# Altium schematic sheet 0151_DC JACK & RTC COIN.SchDoc
size 848 x 558 mm
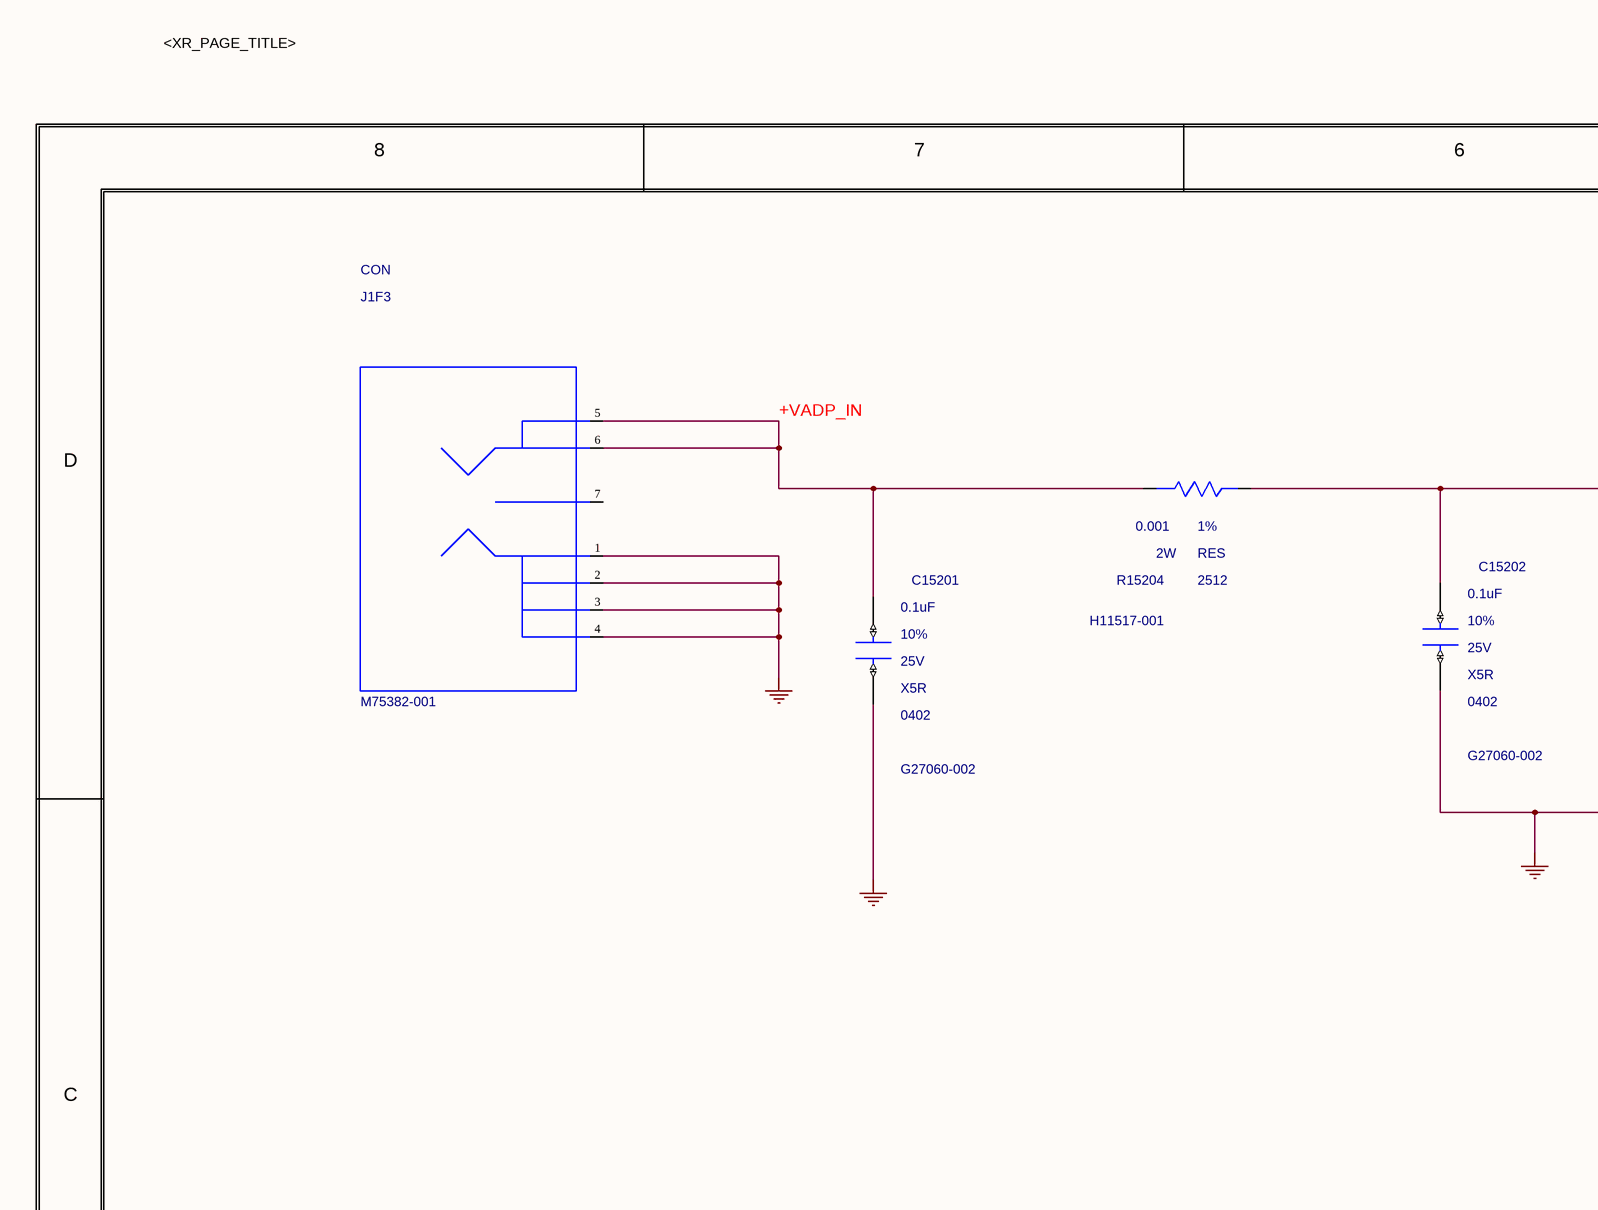
[diagram p0: 0151_DC JACK & RTC COIN.SchDoc, top left]
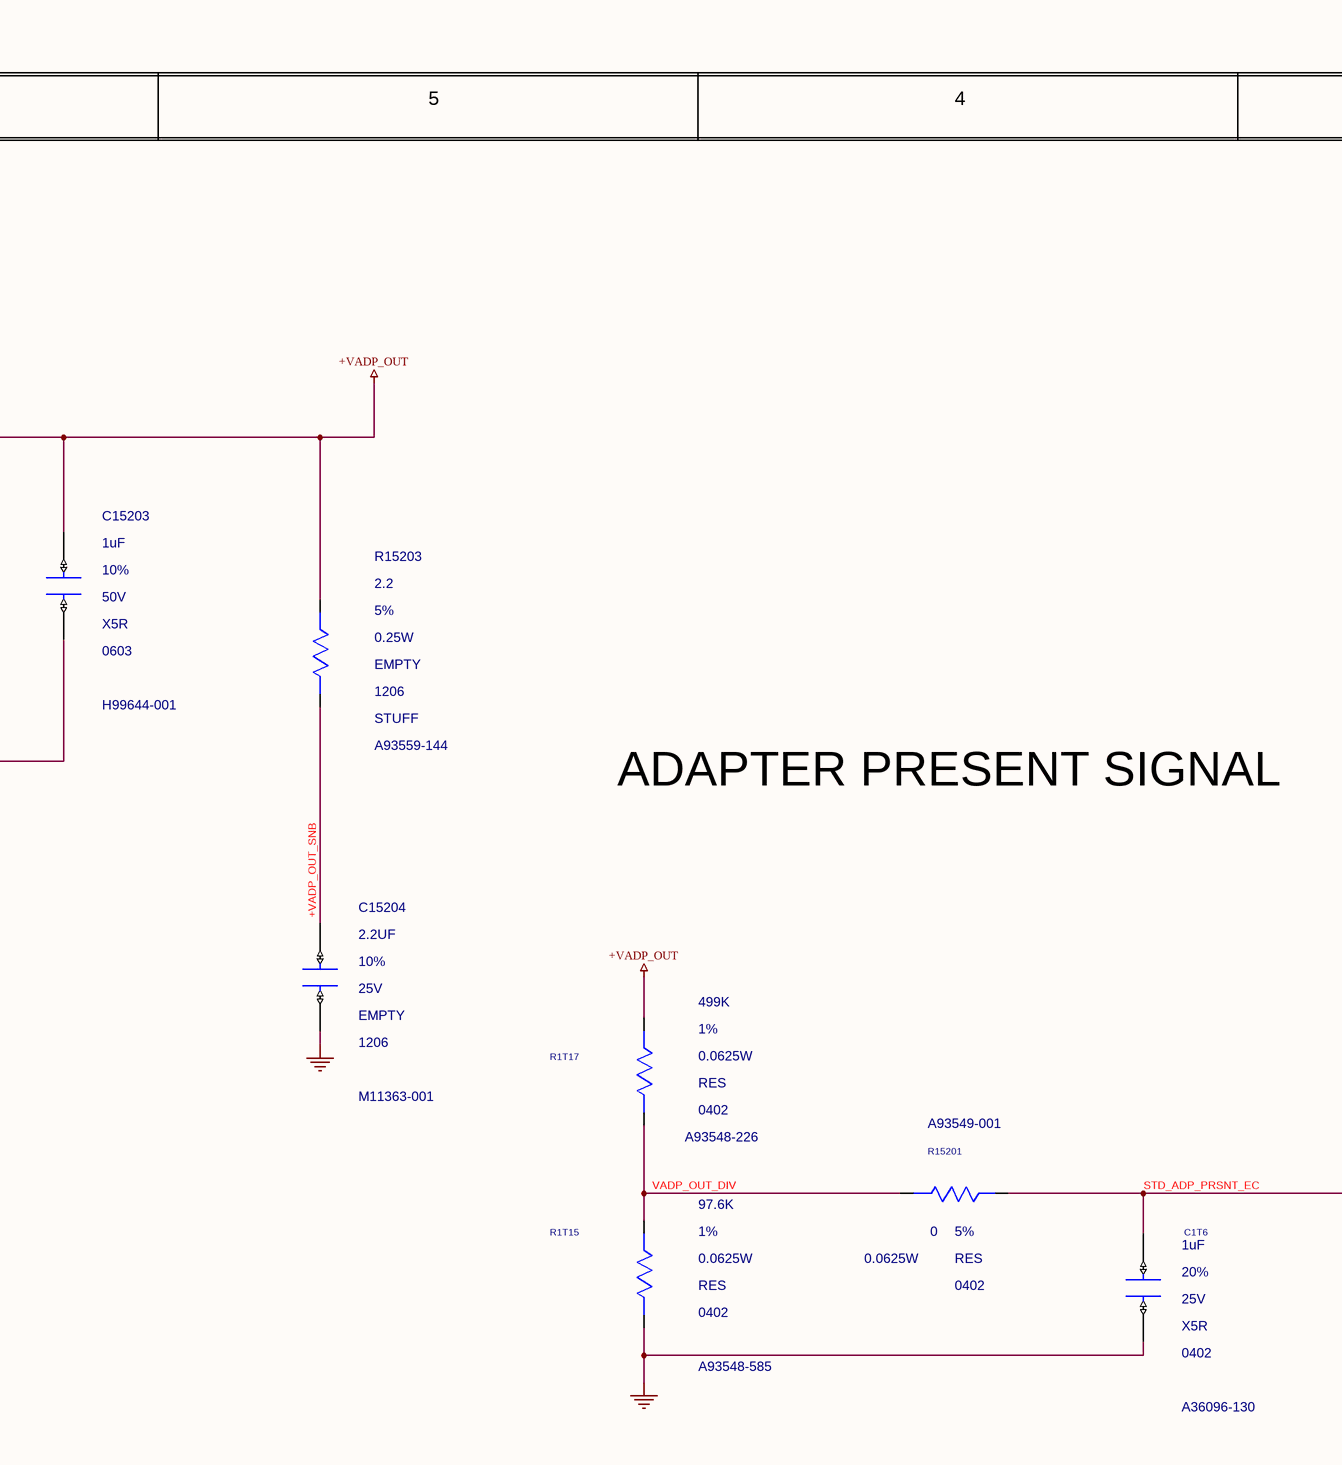
[diagram p1: 0151_DC JACK & RTC COIN.SchDoc, top middle]
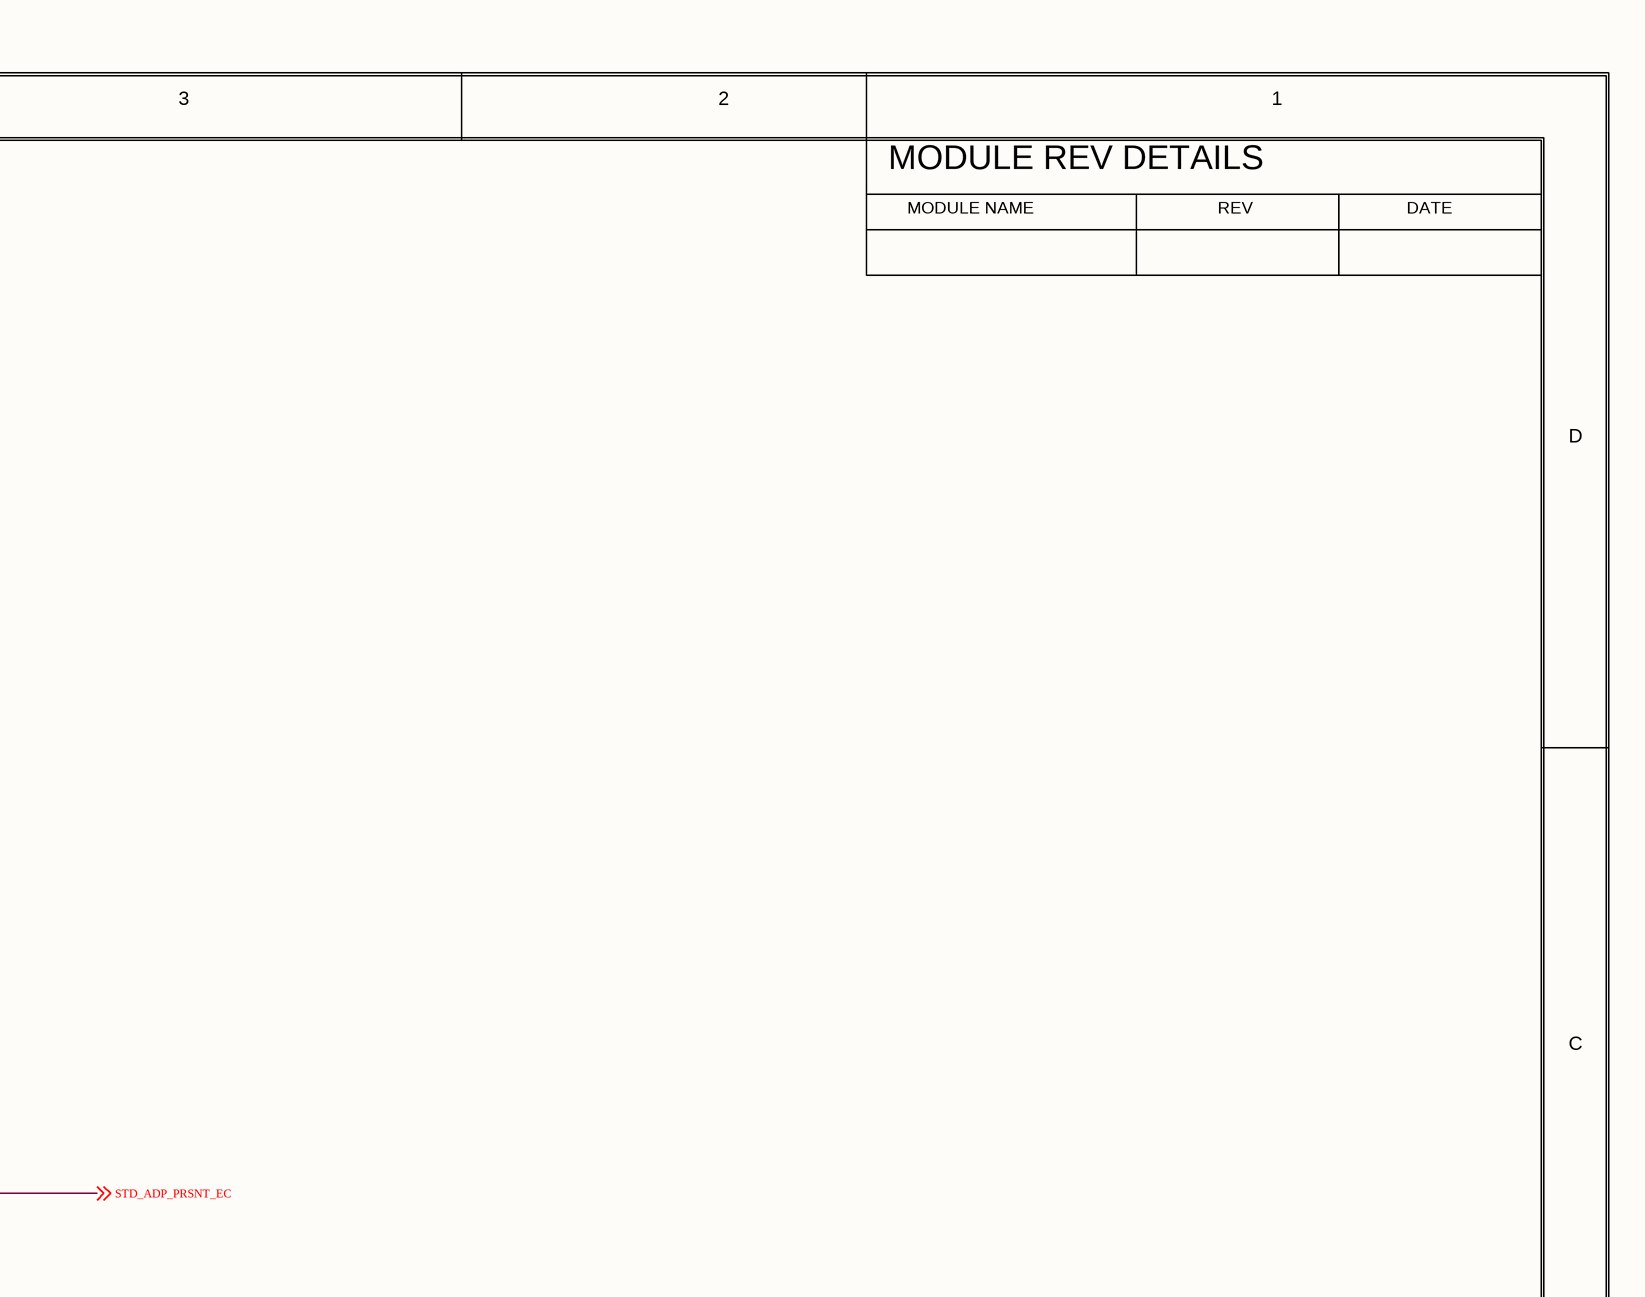
[diagram p2: 0151_DC JACK & RTC COIN.SchDoc, top right]
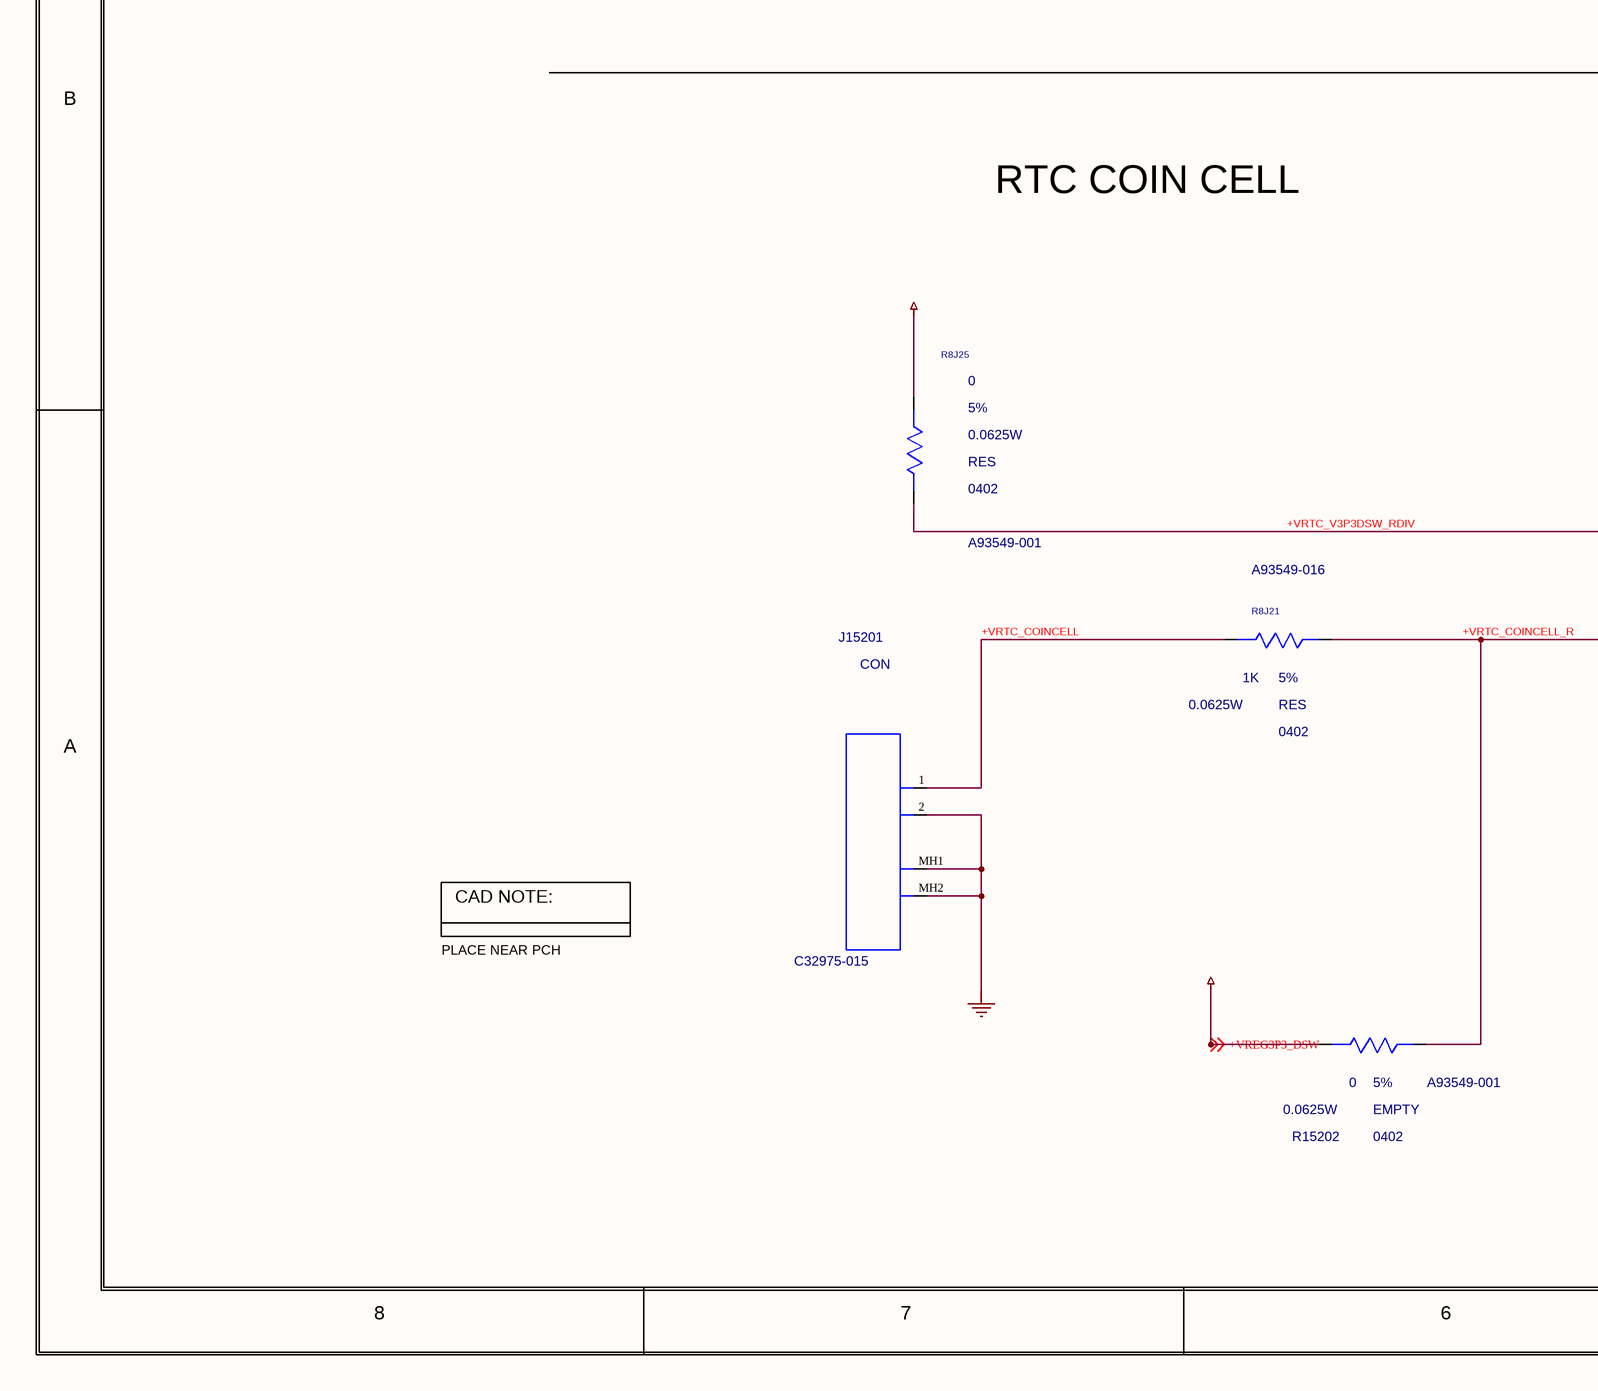
[diagram p3: 0151_DC JACK & RTC COIN.SchDoc, bottom left]
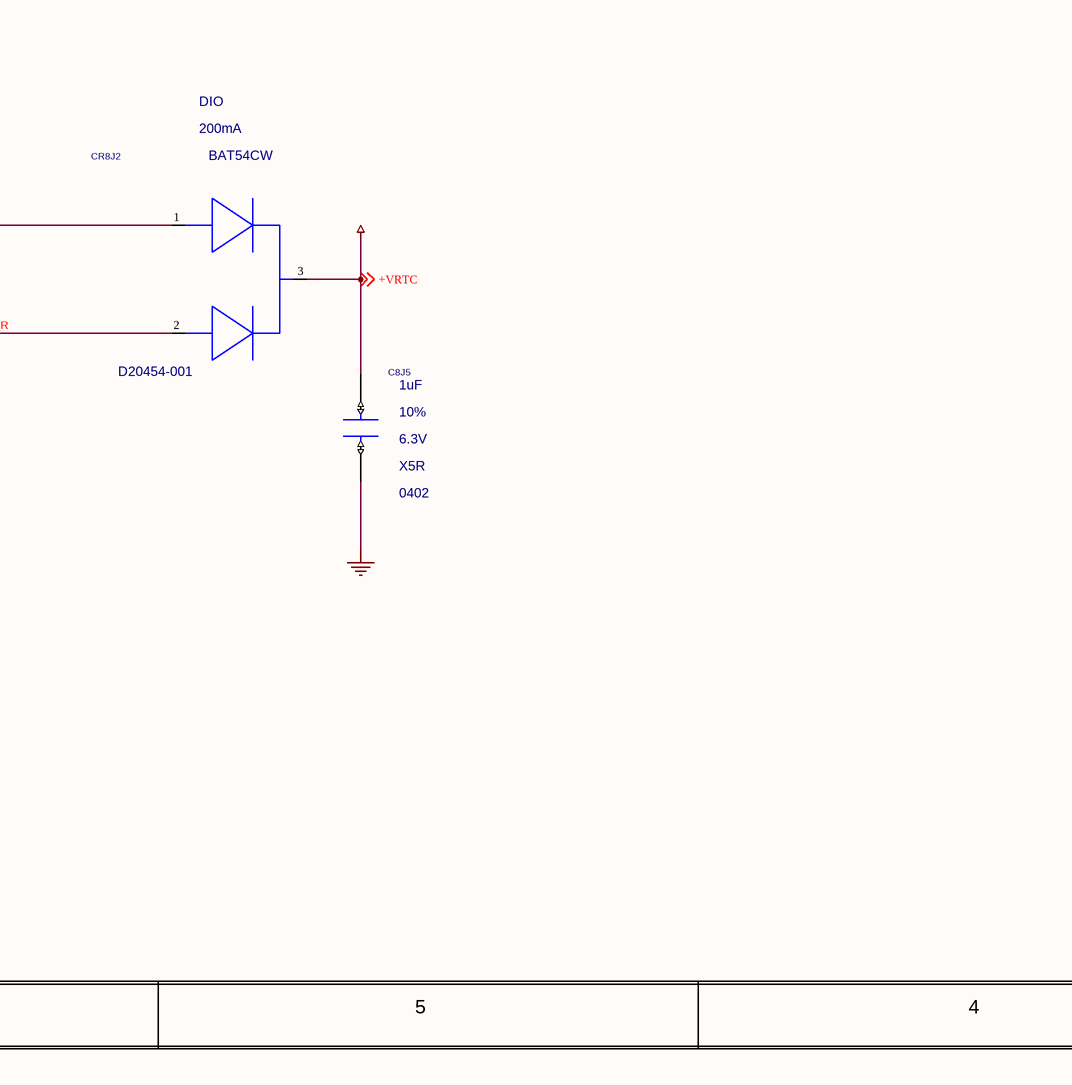
[diagram p4: 0151_DC JACK & RTC COIN.SchDoc, bottom middle]
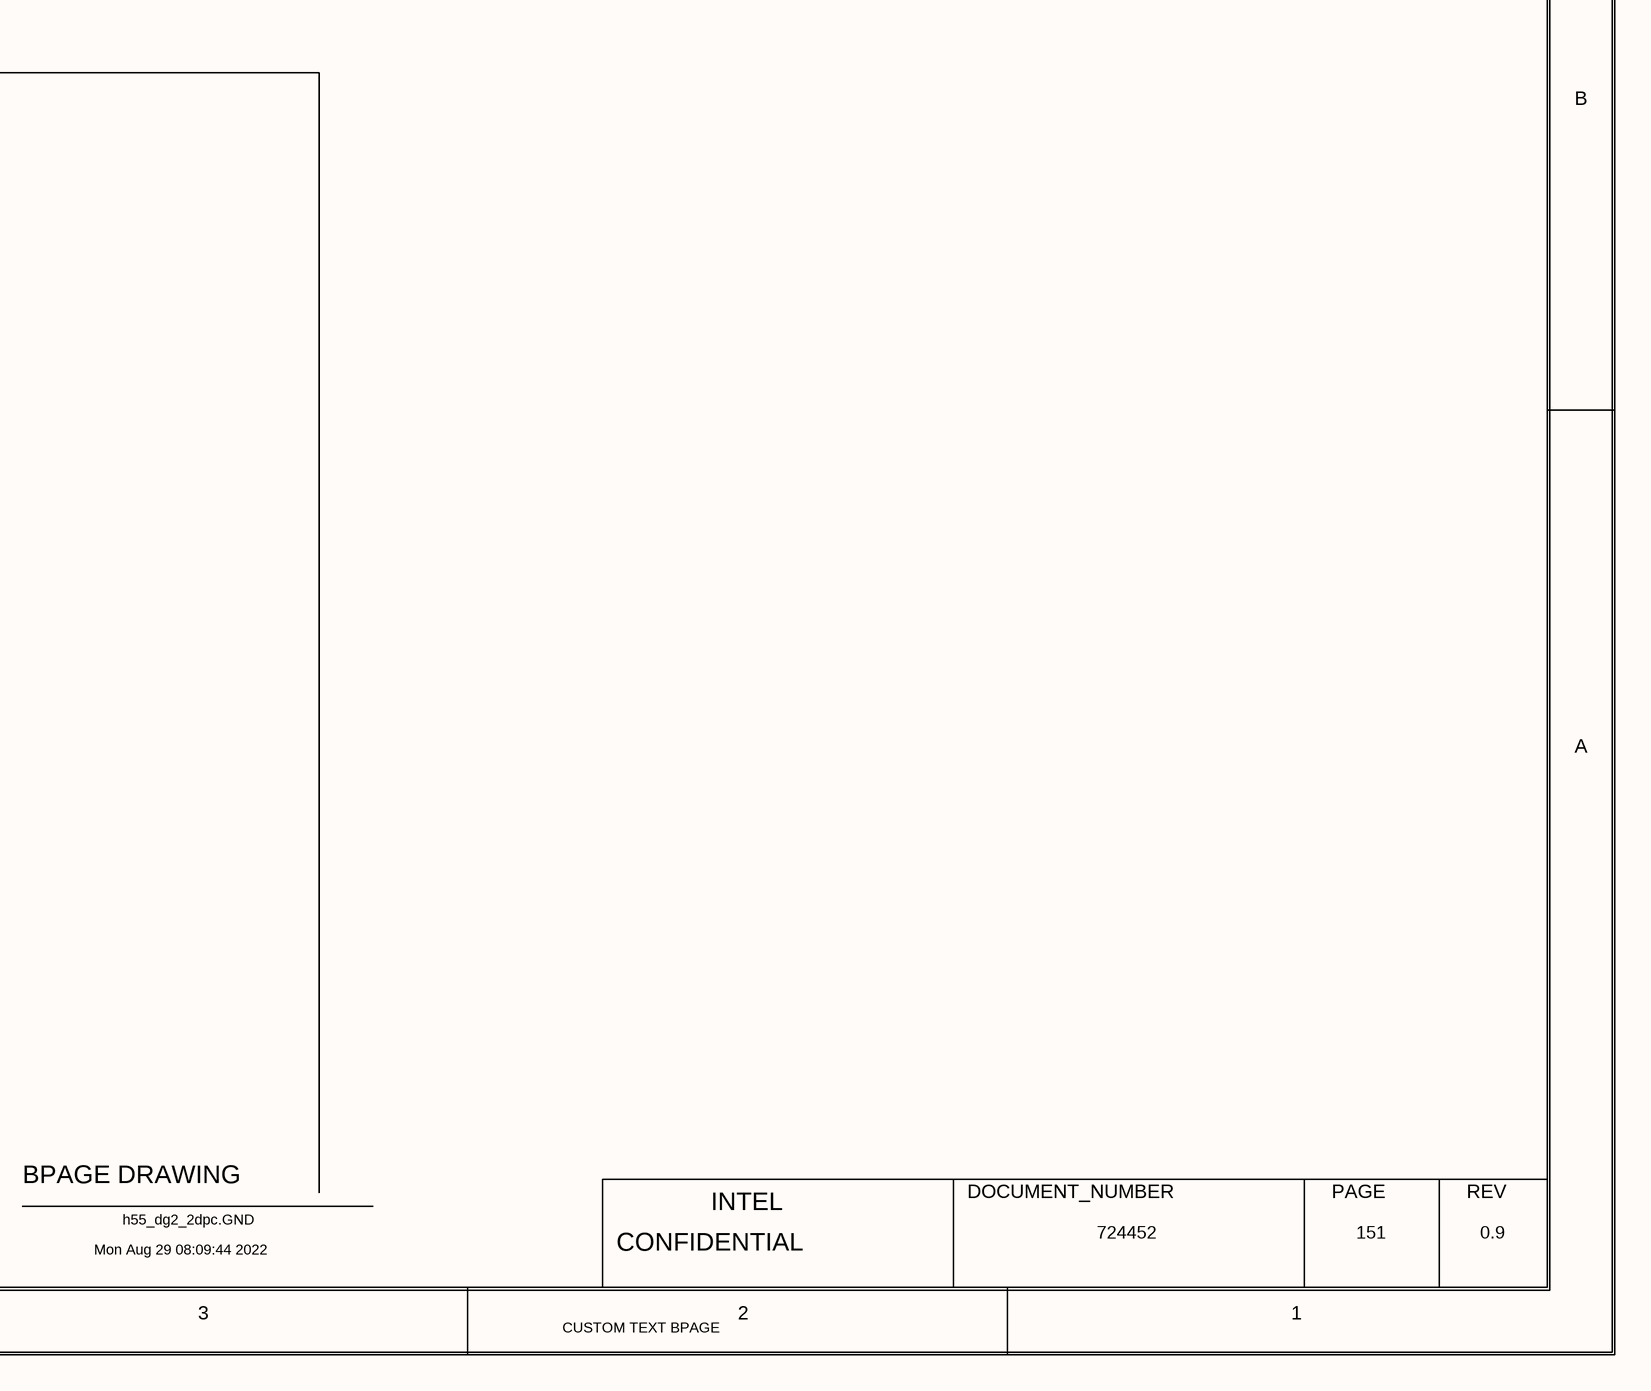
[diagram p5: 0151_DC JACK & RTC COIN.SchDoc, bottom right]

## Parts
C1T6  1uF  MATERIAL: X5R  PACK_TYPE: 0402  PART_NUMBER: A36096-130  TOLERANCE: 20%  VOLTAGE: 25V  [CTK0_SM0402_1050X550_MA]
C8J5  1uF  MATERIAL: X5R  PACK_TYPE: 0402  TOLERANCE: 10%  VOLTAGE: 6.3V  [CTK2_SM0402_1050X550_MA]
C15201  0.1uF  MATERIAL: X5R  PACK_TYPE: 0402  PART_NUMBER: G27060-002  TOLERANCE: 10%  VOLTAGE: 25V  [CTK2_SM0402_1050X550_MA]
C15202  0.1uF  MATERIAL: X5R  PACK_TYPE: 0402  PART_NUMBER: G27060-002  TOLERANCE: 10%  VOLTAGE: 25V  [CTK2_SM0402_1050X550_MA]
C15203  1uF  MATERIAL: X5R  PACK_TYPE: 0603  PART_NUMBER: H99644-001  TOLERANCE: 10%  VOLTAGE: 50V  [CTK0_SM0603_1750X950_MA]
C15204  2.2UF  MATERIAL: EMPTY  PACK_TYPE: 1206  PART_NUMBER: M11363-001  TOLERANCE: 10%  VOLTAGE: 25V  [CTK2_SM1206_3400X1800_MB]
CR8J2  BAT54CW  CURRENT: 200mA  MATERIAL: DIO  PART_NUMBER: D20454-001  [CTK2_SOT323_1350X2200_650_MB]
J1F3  MATERIAL: CON  PART_NUMBER: M75382-001  [CPWR_JACK_MIDJR_7P_1530_MA_PIP_VR]  (hidden comment: C_PWR_JACK_7P)
J15201  MATERIAL: CON  PART_NUMBER: C32975-015  [CTK0_B2B_SPR_1X2_2EM_1250_MA_VR]  (hidden comment: C_B2B_1X2_2EM)
R1T15  97.6K  MATERIAL: RES  PACK_TYPE: 0402  PART_NUMBER: A93548-585  TOLERANCE: 1%  WATTAGE: 0.0625W  [CTK0_SM0402_1100X550_MA]
R1T17  499K  MATERIAL: RES  PACK_TYPE: 0402  PART_NUMBER: A93548-226  TOLERANCE: 1%  WATTAGE: 0.0625W  [CTK0_SM0402_1100X550_MA]
R8J21  1K  MATERIAL: RES  PACK_TYPE: 0402  PART_NUMBER: A93549-016  TOLERANCE: 5%  WATTAGE: 0.0625W  [CTK2_SM0402_1050X550_MA]
R8J25  0  MATERIAL: RES  PACK_TYPE: 0402  PART_NUMBER: A93549-001  TOLERANCE: 5%  WATTAGE: 0.0625W  [CTK0_SM0402_1100X550_MA]
R15201  0  MATERIAL: RES  PACK_TYPE: 0402  PART_NUMBER: A93549-001  TOLERANCE: 5%  WATTAGE: 0.0625W  [CTK0_SM0402_1100X550_MA]
R15202  0  MATERIAL: EMPTY  PACK_TYPE: 0402  PART_NUMBER: A93549-001  TOLERANCE: 5%  WATTAGE: 0.0625W  [CTK0_SM0402_1100X550_MA]
R15203  2.2  BOM_USE: STUFF  MATERIAL: EMPTY  PACK_TYPE: 1206  PART_NUMBER: A93559-144  TOLERANCE: 5%  WATTAGE: 0.25W  [TK0_SM1206_3400X1800_ML]
R15204  0.001  MATERIAL: RES  PACK_TYPE: 2512  PART_NUMBER: H11517-001  TOLERANCE: 1%  WATTAGE: 2W  [CTK2_SM2512_6604X3434_MA]

## Nets
+V3P3DSW: R8J25.1(A)
+VADP_OUT: C15202.1(A) C15203.1(A) R1T17.1(A) R15203.1(A) R15204.2(B)
+VREG3P3_DSW: R15202.1(A) ; off-sheet +VREG3P3_DSW
+VRTC: C8J5.1(A) CR8J2.3(C) ; off-sheet +VRTC
GND: C1T6.2(B) C8J5.2(B) C15201.2(B) C15202.2(B) C15203.2(B) C15204.2(B) J1F3.1(SHELL_M_1) J1F3.2(SHELL_M_2) J1F3.3(SHELL_M_3) J1F3.4(SHELL_M_4) J15201.2(IO2) J15201.MH1 J15201.MH2 R1T15.2(B)
+VADP_IN: C15201.1(A) J1F3.5(SPRING_P_1) J1F3.6(SPRING_P_2) R15204.1(A)
+VADP_OUT_SNB: C15204.1(A) R15203.2(B)
+VRTC_COINCELL: J15201.1(IO1) R8J21.1(A)
+VRTC_COINCELL_R: CR8J2.2(A2) R8J21.2(B) R15202.2(B)
+VRTC_V3P3DSW_RDIV: CR8J2.1(A1) R8J25.2(B)
STD_ADP_PRSNT_EC: C1T6.1(A) R15201.2(B) ; off-sheet STD_ADP_PRSNT_EC
VADP_OUT_DIV: R1T15.1(A) R1T17.2(B) R15201.1(A)

Not connected (* = marked no-connect by the designer): J1F3 7(ID)

## Notes on the sheet
- <XR_PAGE_TITLE>
- 8
- 7
- 6
- 5
- 4
- 3
- 2
- 1
- MODULE REV DETAILS
- MODULE NAME
- REV
- DATE
- D
- ADAPTER PRESENT SIGNAL
- C
- B
- RTC COIN CELL
- A
- CAD NOTE:
- PLACE NEAR PCH
- BPAGE DRAWING
- INTEL
- DOCUMENT_NUMBER
- PAGE
- Mon Aug 29 08:09:44 2022
- h55_dg2_2dpc.GND
- CONFIDENTIAL
- 724452
- 151
- 0.9
- CUSTOM TEXT BPAGE

## Library data of the parts
C1T6 = C_CAP: CDS_PHYS_PART_NAME: C_CAP_0402-A36096-130,X5R,1UF,25V,20%,TK0,GENERIC; CDS_LMAN_SYM_OUTLINE: -50,50,50,-50; FP_TECH: TK0; IP: GENERIC; ROOM: NONE; OriginalSymbolOrigin: (-50,25); XY: (6100,1950); VER: 1; ROT: 0; PHYS_PAGE: 151; LOCATION: C1T6; DRAWING: @RVP1_ADL_SB_ADP_S_DDR5_SODIMM_2DPC_LIB.H55_DG2_2DPC(SCH_1):PAGE520; CDS_LIB: c_discrete; VARIANT: ?; PCB Footprint: CTK0_SM0402_1050X550_MA; CHIPS_PART_NAME: C_CAP; CDS_PART_NAME: C_CAP_0402-A36096-130,X5R,1UF,25V,20%,TK0,GENERIC; CDS_LOCATION: C1T6
C8J5 = C_CAP: PART_NUMBER: A36096-027; CDS_PHYS_PART_NAME: CAP_402-1UF,10%,16V"; CDS_PART_NAME: C_CAP_0402-A36096-027,X5R,1UF,6.3V,10%,TK2,GENERIC; CDS_LMAN_SYM_OUTLINE: -50,50,50,-50; FP_TECH: TK2; IP: GENERIC; ROOM: NONE; OriginalSymbolOrigin: (-50,25); XY: (4650,100); VER: 1; ROT: 0; PHYS_PAGE: 151; LOCATION: C8J5; DRAWING: @RVP1_ADL_SB_ADP_S_DDR5_SODIMM_2DPC_LIB.H55_DG2_2DPC(SCH_1):PAGE520; CDS_LIB: c_discrete; VARIANT: ?; PCB Footprint: CTK2_SM0402_1050X550_MA; CHIPS_PART_NAME: C_CAP; CDS_LOCATION: C8J5; ASI_MODEL: A36096-027
C15201 = C_CAP: CDS_PHYS_PART_NAME: C_CAP_0402-G27060-002,X5R,0.1UF,25V,10%,TK2,GENERIC; CDS_LMAN_SYM_OUTLINE: -50,50,50,-50; FP_TECH: TK2; IP: GENERIC; ROOM: NONE; OriginalSymbolOrigin: (-50,25); XY: (2700,3225); VER: 1; ROT: 0; PHYS_PAGE: 151; LOCATION: C15201; DRAWING: @RVP1_ADL_SB_ADP_S_DDR5_SODIMM_2DPC_LIB.H55_DG2_2DPC(SCH_1):PAGE520; CDS_LIB: c_discrete; VARIANT: ?; PCB Footprint: CTK2_SM0402_1050X550_MA; CHIPS_PART_NAME: C_CAP; CDS_PART_NAME: C_CAP_0402-G27060-002,X5R,0.1UF,25V,10%,TK2,GENERIC; CDS_LOCATION: C15201
C15202 = C_CAP: CDS_PHYS_PART_NAME: C_CAP_0402-G27060-002,X5R,0.1UF,25V,10%,TK2,GENERIC; CDS_LMAN_SYM_OUTLINE: -50,50,50,-50; FP_TECH: TK2; IP: GENERIC; ROOM: NONE; OriginalSymbolOrigin: (-50,25); XY: (3750,3250); VER: 1; ROT: 0; PHYS_PAGE: 151; LOCATION: C15202; DRAWING: @RVP1_ADL_SB_ADP_S_DDR5_SODIMM_2DPC_LIB.H55_DG2_2DPC(SCH_1):PAGE520; CDS_LIB: c_discrete; VARIANT: ?; PCB Footprint: CTK2_SM0402_1050X550_MA; CHIPS_PART_NAME: C_CAP; CDS_PART_NAME: C_CAP_0402-G27060-002,X5R,0.1UF,25V,10%,TK2,GENERIC; CDS_LOCATION: C15202
C15203 = C_CAP: CDS_PHYS_PART_NAME: C_CAP_0603-H99644-001,X5R,1UF,50V,10%,TK0,GENERIC; CDS_LMAN_SYM_OUTLINE: -50,50,50,-50; FP_TECH: TK0; IP: GENERIC; ROOM: NONE; OriginalSymbolOrigin: (-50,25); XY: (4100,3250); VER: 1; ROT: 0; PHYS_PAGE: 151; LOCATION: C15203; DRAWING: @RVP1_ADL_SB_ADP_S_DDR5_SODIMM_2DPC_LIB.H55_DG2_2DPC(SCH_1):PAGE520; CDS_LIB: c_discrete; VARIANT: ?; PCB Footprint: CTK0_SM0603_1750X950_MA; CHIPS_PART_NAME: C_CAP; CDS_PART_NAME: C_CAP_0603-H99644-001,X5R,1UF,50V,10%,TK0,GENERIC; CDS_LOCATION: C15203
C15204 = C_CAP: CDS_PHYS_PART_NAME: C_CAP_1206-M11363-001,EMPTY,2.2UF,25V,10%,TK2,GENERIC; CDS_LMAN_SYM_OUTLINE: -50,50,50,-50; FP_TECH: TK2; IP: GENERIC; ROOM: NONE; OriginalSymbolOrigin: (-50,25); XY: (4575,2525); VER: 1; ROT: 0; PHYS_PAGE: 151; LOCATION: C15204; DRAWING: @RVP1_ADL_SB_ADP_S_DDR5_SODIMM_2DPC_LIB.H55_DG2_2DPC(SCH_1):PAGE520; CDS_LIB: c_discrete; VARIANT: ?; PCB Footprint: CTK2_SM1206_3400X1800_MB; CHIPS_PART_NAME: C_CAP; CDS_PART_NAME: C_CAP_1206-M11363-001,EMPTY,2.2UF,25V,10%,TK2,GENERIC; CDS_LOCATION: C15204
CR8J2 = C_BAT54C: CDS_PHYS_PART_NAME: BAT54C_SMALLSM-C52251-001,DISCRETE,BAT54C,200MA,LPDB,GENERIC"; CDS_PART_NAME: C_BAT54C_SOT323-D20454-001,DIO,BAT54CW,200MA,TK2,GENERIC; CDS_LMAN_SYM_OUTLINE: -100,150,50,-150; FP_TECH: TK2; IP: GENERIC; PACK_TYPE: SOT323; ROOM: NONE; OriginalSymbolOrigin: (-125,150); XY: (4450,375); VER: 1; ROT: 0; PHYS_PAGE: 151; LOCATION: CR8J2; DRAWING: @RVP1_ADL_SB_ADP_S_DDR5_SODIMM_2DPC_LIB.H55_DG2_2DPC(SCH_1):PAGE520; CDS_LIB: local; VARIANT: ?; PCB Footprint: CTK2_SOT323_1350X2200_650_MB; CHIPS_PART_NAME: C_BAT54C; CDS_LOCATION: CR8J2; ASI_MODEL: D20454-001
J1F3 = C_PWR_JACK_7P: CDS_PHYS_PART_NAME: C_PWR_JACK_7P_TH-M75382-001,CON,PWR_JACK_7P,TK0,GENERIC; CDS_LMAN_SYM_OUTLINE: -200,300,200,-300; FP_TECH: TK0; IP: GENERIC; PACK_TYPE: TH; ROOM: NONE; OriginalSymbolOrigin: (-200,300); XY: (1950,3450); VER: 1; ROT: 0; PHYS_PAGE: 151; LOCATION: J1F3; DRAWING: @RVP1_ADL_SB_ADP_S_DDR5_SODIMM_2DPC_LIB.H55_DG2_2DPC(SCH_1):PAGE520; CDS_LIB: local; VARIANT: ?; PCB Footprint: CPWR_JACK_MIDJR_7P_1530_MA_PIP_VR; CHIPS_PART_NAME: C_PWR_JACK_7P; CDS_PART_NAME: C_PWR_JACK_7P_TH-M75382-001,CON,PWR_JACK_7P,TK0,GENERIC; CDS_LOCATION: J1F3
J15201 = C_B2B_1X2_2EM: CDS_PHYS_PART_NAME: C_B2B_1X2_2EM_SM-C32975-015,CON,B2B_1X2_2EM,TK0,GENERIC; CDS_LMAN_SYM_OUTLINE: -50,200,50,-200; FP_TECH: TK0; IP: GENERIC; PACK_TYPE: SM; ROOM: NONE; OriginalSymbolOrigin: (-75,200); XY: (2700,-100); VER: 1; ROT: 2; PHYS_PAGE: 151; LOCATION: J15201; DRAWING: @RVP1_ADL_SB_ADP_S_DDR5_SODIMM_2DPC_LIB.H55_DG2_2DPC(SCH_1):PAGE520; CDS_LIB: local; VARIANT: ?; PCB Footprint: CTK0_B2B_SPR_1X2_2EM_1250_MA_VR; CHIPS_PART_NAME: C_B2B_1X2_2EM; CDS_PART_NAME: C_B2B_1X2_2EM_SM-C32975-015,CON,B2B_1X2_2EM,TK0,GENERIC; CDS_LOCATION: J15201
R1T15 = C_RES: CDS_PHYS_PART_NAME: C_RES_0402-A93548-585,RES,97.6K,1%,0.0625W,TK0,GENERIC; CDS_LMAN_SYM_OUTLINE: -50,50,50,-50; FP_TECH: TK0; IP: GENERIC; ROOM: NONE; OriginalSymbolOrigin: (-25,75); XY: (5175,1975); VER: 2; ROT: 0; PHYS_PAGE: 151; LOCATION: R1T15; DRAWING: @RVP1_ADL_SB_ADP_S_DDR5_SODIMM_2DPC_LIB.H55_DG2_2DPC(SCH_1):PAGE520; CDS_LIB: c_discrete; VARIANT: ?; PCB Footprint: CTK0_SM0402_1100X550_MA; CHIPS_PART_NAME: C_RES; CDS_PART_NAME: C_RES_0402-A93548-585,RES,97.6K,1%,0.0625W,TK0,GENERIC; CDS_LOCATION: R1T15
R1T17 = C_RES: CDS_PHYS_PART_NAME: C_RES_0402-A93548-226,RES,499K,1%,0.0625W,TK0,GENERIC; CDS_LMAN_SYM_OUTLINE: -50,50,50,-50; FP_TECH: TK0; IP: GENERIC; ROOM: NONE; OriginalSymbolOrigin: (-25,75); XY: (5175,2350); VER: 2; ROT: 0; PHYS_PAGE: 151; LOCATION: R1T17; DRAWING: @RVP1_ADL_SB_ADP_S_DDR5_SODIMM_2DPC_LIB.H55_DG2_2DPC(SCH_1):PAGE520; CDS_LIB: c_discrete; VARIANT: ?; PCB Footprint: CTK0_SM0402_1100X550_MA; CHIPS_PART_NAME: C_RES; CDS_PART_NAME: C_RES_0402-A93548-226,RES,499K,1%,0.0625W,TK0,GENERIC; CDS_LOCATION: R1T17
R8J21 = C_RES#1: CHIPS_PART_NAME: C_RES; CDS_PHYS_PART_NAME: RES_0402-A93548-023,CHIP,1K,1%,1/16W,LPDB,GENERIC"; CDS_PART_NAME: C_RES_0402-A93549-016,RES,1K,5%,0.0625W,TK2,GENERIC; CDS_LMAN_SYM_OUTLINE: -50,50,50,-50; FP_TECH: TK2; IP: GENERIC; ROOM: NONE; OriginalSymbolOrigin: (-75,25); XY: (3450,275); VER: 1; ROT: 0; PHYS_PAGE: 151; LOCATION: R8J21; DRAWING: @RVP1_ADL_SB_ADP_S_DDR5_SODIMM_2DPC_LIB.H55_DG2_2DPC(SCH_1):PAGE520; CDS_LIB: c_discrete; VARIANT: ?; PCB Footprint: CTK2_SM0402_1050X550_MA; CDS_LOCATION: R8J21; ASI_MODEL: A93549-016
R8J25 = C_RES: CDS_PHYS_PART_NAME: RES_0402-A93549-001,CHIP,0,5%,1/16W,LPDB,GENERIC"; CDS_PART_NAME: C_RES_0402-A93549-001,RES,0,5%,0.0625W,TK0,GENERIC; CDS_LMAN_SYM_OUTLINE: -50,50,50,-50; FP_TECH: TK0; IP: GENERIC; ROOM: NONE; OriginalSymbolOrigin: (-25,75); XY: (2775,625); VER: 2; PHYS_PAGE: 151; LOCATION: R8J25; DRAWING: @RVP1_ADL_SB_ADP_S_DDR5_SODIMM_2DPC_LIB.H55_DG2_2DPC(SCH_1):PAGE520; CDS_LIB: c_discrete; BOM: CORE_VR; VARIANT: ?; PCB Footprint: CTK0_SM0402_1100X550_MA; ROT: 0; CHIPS_PART_NAME: C_RES; CDS_LOCATION: R8J25; ASI_MODEL: A93549-001
R15201 = C_RES#1: CHIPS_PART_NAME: C_RES; CDS_PHYS_PART_NAME: C_RES_0402-A93549-001,RES,0,5%,0.0625W,TK0,GENERIC; CDS_LMAN_SYM_OUTLINE: -50,50,50,-50; FP_TECH: TK0; IP: GENERIC; ROOM: NONE; OriginalSymbolOrigin: (-75,25); XY: (5750,2125); VER: 1; PHYS_PAGE: 151; LOCATION: R15201; DRAWING: @RVP1_ADL_SB_ADP_S_DDR5_SODIMM_2DPC_LIB.H55_DG2_2DPC(SCH_1):PAGE520; CDS_LIB: c_discrete; VARIANT: ?; PCB Footprint: CTK0_SM0402_1100X550_MA; ROT: 0; CDS_PART_NAME: C_RES_0402-A93549-001,RES,0,5%,0.0625W,TK0,GENERIC; CDS_LOCATION: R15201
R15202 = C_RES#1: CHIPS_PART_NAME: C_RES; CDS_PHYS_PART_NAME: C_RES_0402-A93549-001,EMPTY,0,5%,0.0625W,TK0,GENERIC; CDS_LMAN_SYM_OUTLINE: -50,50,50,-50; FP_TECH: TK0; IP: GENERIC; ROOM: NONE; OriginalSymbolOrigin: (-75,25); XY: (3625,-475); VER: 1; PHYS_PAGE: 151; LOCATION: R15202; DRAWING: @RVP1_ADL_SB_ADP_S_DDR5_SODIMM_2DPC_LIB.H55_DG2_2DPC(SCH_1):PAGE520; CDS_LIB: c_discrete; VARIANT: ?; PCB Footprint: CTK0_SM0402_1100X550_MA; ROT: 0; CDS_PART_NAME: C_RES_0402-A93549-001,EMPTY,0,5%,0.0625W,TK0,GENERIC; CDS_LOCATION: R15202
R15203 = RES_2: CDS_PHYS_PART_NAME: RES_2_1206-A93559-144,EMPTY,2.2,5%,0.25W,TK0,GENERIC; CDS_LMAN_SYM_OUTLINE: -50,50,50,-50; FP_TECH: TK0; IP: GENERIC; ROOM: NONE; OriginalSymbolOrigin: (-25,75); XY: (4575,3125); VER: 2; ROT: 0; PHYS_PAGE: 151; LOCATION: R15203; DRAWING: @RVP1_ADL_SB_ADP_S_DDR5_SODIMM_2DPC_LIB.H55_DG2_2DPC(SCH_1):PAGE520; CDS_LIB: discrete_2; VARIANT: ?; PCB Footprint: TK0_SM1206_3400X1800_ML; CHIPS_PART_NAME: RES_2; CDS_PART_NAME: RES_2_1206-A93559-144,EMPTY,2.2,5%,0.25W,TK0,GENERIC; CDS_LOCATION: R15203
R15204 = C_RES#1: CHIPS_PART_NAME: C_RES; CDS_PHYS_PART_NAME: C_RES_2512-H11517-001,RES,0.001,1%,2W,TK2,GENERIC; CDS_LMAN_SYM_OUTLINE: -50,50,50,-50; FP_TECH: TK2; IP: GENERIC; ROOM: NONE; OriginalSymbolOrigin: (-75,25); XY: (3300,3525); VER: 1; ROT: 0; PHYS_PAGE: 151; LOCATION: R15204; DRAWING: @RVP1_ADL_SB_ADP_S_DDR5_SODIMM_2DPC_LIB.H55_DG2_2DPC(SCH_1):PAGE520; CDS_LIB: c_discrete; VARIANT: ?; PCB Footprint: CTK2_SM2512_6604X3434_MA; CDS_PART_NAME: C_RES_2512-H11517-001,RES,0.001,1%,2W,TK2,GENERIC; CDS_LOCATION: R15204